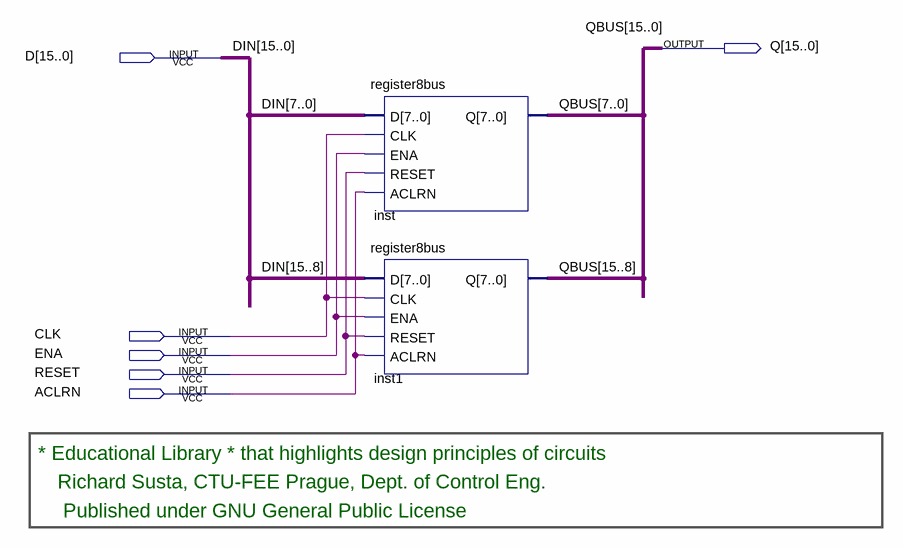
[diagram p0: schematic sheet]
// Quartus schematic register16bus.bdf as structural Verilog: 2 symbols, 6 pins
module register16bus (
  input  [15:0] D,
  input  CLK,
  input  ENA,
  input  RESET,
  input  ACLRN,
  output [15:0] Q
);

  register8bus inst (.D(D[7:0]), .CLK(CLK), .ENA(ENA), .RESET(RESET), .ACLRN(ACLRN), .Q(Q[7:0]));
  register8bus inst1 (.D(D[15:8]), .CLK(CLK), .ENA(ENA), .RESET(RESET), .ACLRN(ACLRN), .Q(Q[15:8]));

  // Other names for the same wires on the sheet: DIN[15:0] = D; QBUS[15:0] = Q

  // Notes on the sheet:
  //   * Educational Library * that highlights design principles of circuits
  //   Richard Susta, CTU-FEE Prague, Dept. of Control Eng. 
  //    Published under GNU General Public License
endmodule
